# Altium project only pins.PrjPcb
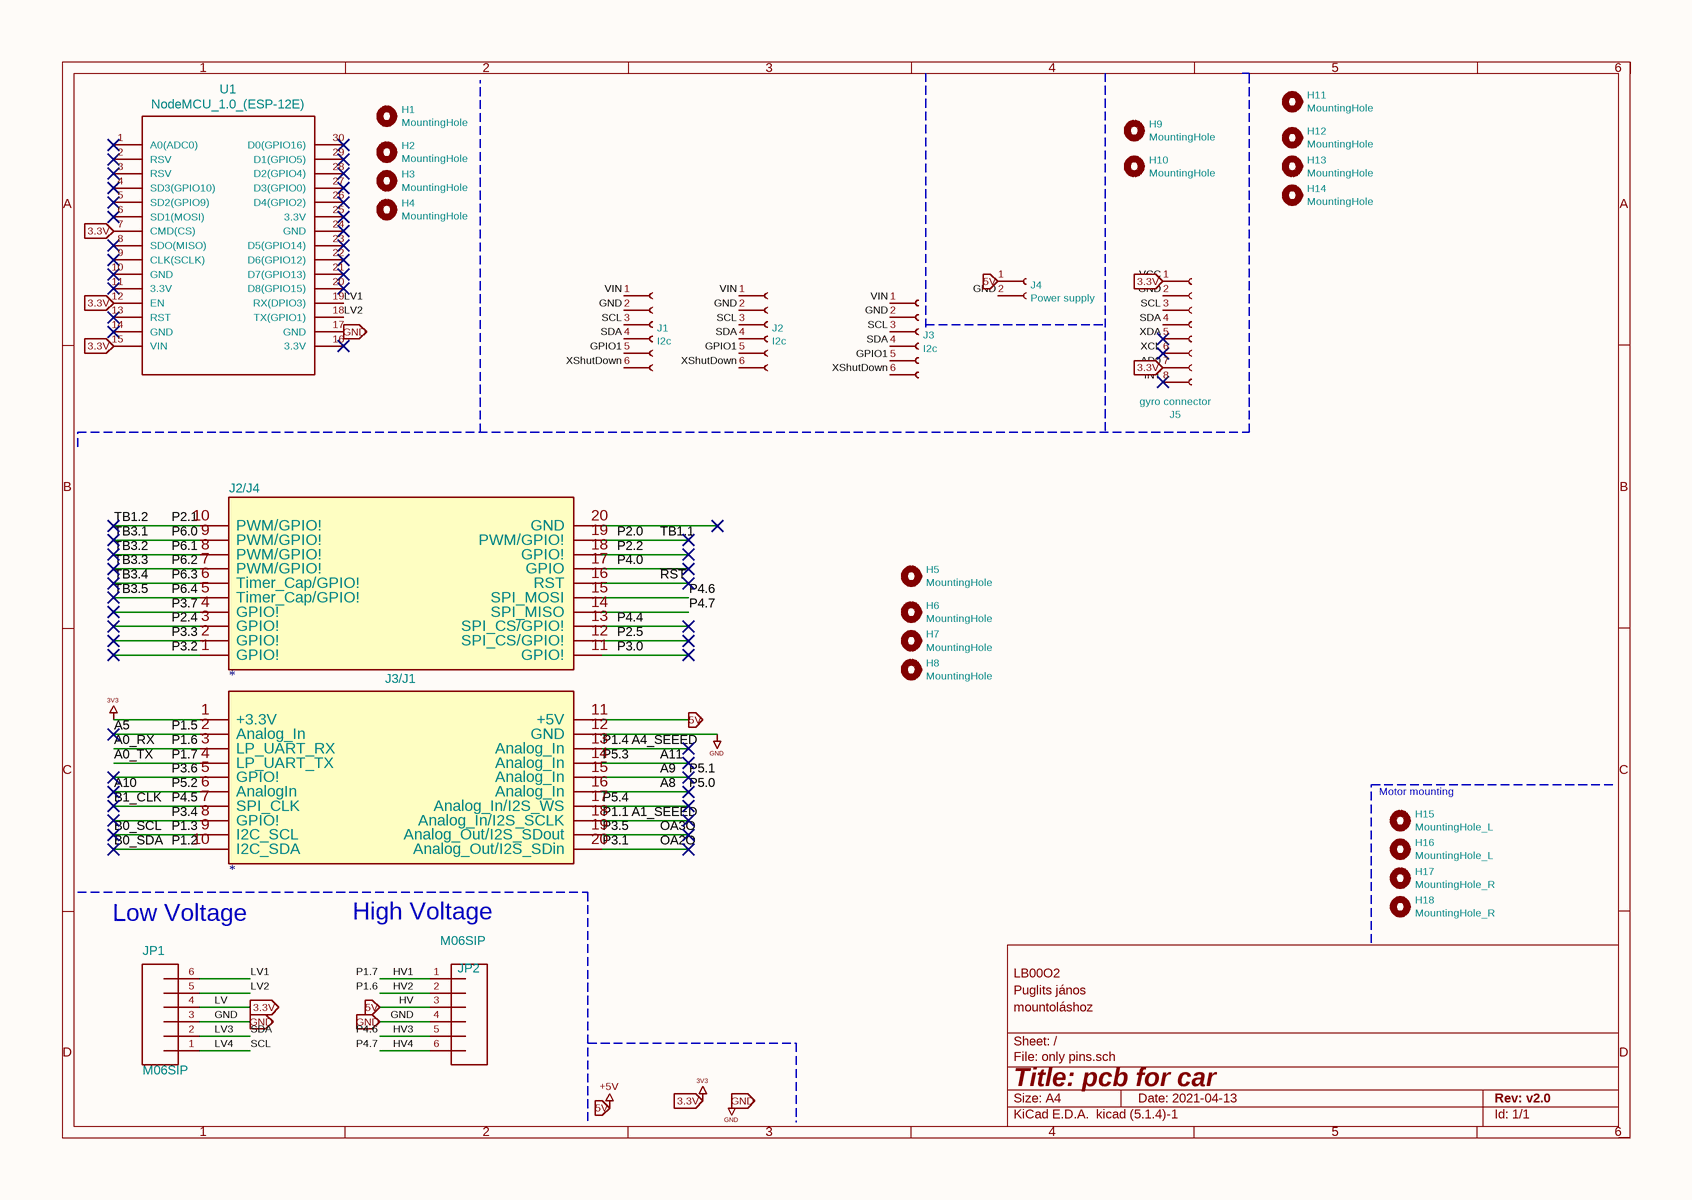
[diagram p0: only pins.SchDoc]
1 sheet, 28 parts. Net scope: flat (ports and power ports of the same name join across sheets).
Board files: only pins.PcbDoc, only pins(1).PcbDoc

## Sheet only pins.SchDoc
size 297 x 210 mm

### Parts
H1  MountingHole  [MountingHole_2.7mm]
H2  MountingHole  [MountingHole_2.7mm]
H3  MountingHole  [MountingHole_2.7mm]
H4  MountingHole  [MountingHole_2.7mm]
H5  MountingHole  [MountingHole_2.7mm]
H6  MountingHole  [MountingHole_2.7mm]
H7  MountingHole  [MountingHole_2.7mm]
H8  MountingHole  [MountingHole_2.7mm]
H9  MountingHole  [MountingHole_2.7mm]
H10  MountingHole  [MountingHole_2.7mm]
H11  MountingHole  [MountingHole_2.7mm]
H12  MountingHole  [MountingHole_2.7mm]
H13  MountingHole  [MountingHole_2.7mm]
H14  MountingHole  [MountingHole_2.7mm]
H15  MountingHole_L  [MountingHole_2.7mm]
H16  MountingHole_L  [MountingHole_2.7mm]
H17  MountingHole_R  [MountingHole_2.7mm]
H18  MountingHole_R  [MountingHole_2.7mm]
J1  I2c  [PinSocket_1x06_P2.54mm_Vertical]
J2  I2c  [PinSocket_1x06_P2.54mm_Vertical]
J2/J4  *  [PinSocket_2x10_P2.54mm_Vertical]
J3  I2c  [PinSocket_1x06_P2.54mm_Vertical]
J3/J1  *  [PinSocket_2x10_P2.54mm_Vertical]
J4  Power supply  [SolderWire-0.1sqmm_1x02_P3.6mm_D0.4mm_OD1mm]
J5  gyro connector  [PinSocket_1x08_P2.54mm_Vertical]
JP1  M06SIP  [PinSocket_1x06_P2.54mm_Vertical]
JP2  M06SIP  [PinSocket_1x06_P2.54mm_Vertical]
U1  NodeMCU_1.0_(ESP-12E)  [NodeMCU1.0(12-E)]

### Ports
3.3V, 5V, GND

### Nets
AD0: J3/J1.1(+3.3V) J5.1(Pin_1) J5.7(Pin_7) JP1.4 U1.7(CMD(CS)) U1.12(EN) U1.15(VIN) ; port 3.3V  [also labelled 3V3, LV, VCC]
GND: J1.2(Pin_2) J2.2(Pin_2) J3.2(Pin_2) J3/J1.12(GND) J4.2(Pin_2) J5.2(Pin_2) JP1.3 JP2.4 U1.17(GND) ; port GND
HV: J3/J1.11(+5V) J4.1(Pin_1) JP2.3 ; port 5V  [also labelled +5V]
A0_RX: J3/J1.3(LP_UART_RX) JP2.2  [also labelled HV2, P1.6]
A0_TX: J3/J1.4(LP_UART_TX) JP2.1  [also labelled HV1, P1.7]
A1_SEEED: J3/J1.18(Analog_In/I2S_SCLK)  [also labelled P1.1]
A4_SEEED: J3/J1.13(Analog_In)  [also labelled P1.4]
A5: J3/J1.2(Analog_In)  [also labelled P1.5]
A8: J3/J1.16(Analog_In)  [also labelled P5.0]
A9: J3/J1.15(Analog_In)  [also labelled P5.1]
A10: J3/J1.6(AnalogIn)  [also labelled P5.2]
A11: J3/J1.14(Analog_In)  [also labelled P5.3]
B0_SCL: J3/J1.9(I2C_SCL)  [also labelled P1.3]
B0_SDA: J3/J1.10(I2C_SDA)  [also labelled P1.2]
B1_CLK: J3/J1.7(SPI_CLK)  [also labelled P4.5]
GPIO1: J1.5(Pin_5) J2.5(Pin_5) J3.5(Pin_5)
HV3: J2/J4.15(SPI_MOSI) JP2.5  [also labelled P4.6]
HV4: J2/J4.14(SPI_MISO) JP2.6  [also labelled P4.7]
INT: J5.8(Pin_8)
LV1: JP1.6 U1.19(RX(DPIO3))
LV2: JP1.5 U1.18(TX(GPIO1))
LV3: J1.4(Pin_4) J2.4(Pin_4) J3.4(Pin_4) J5.4(Pin_4) JP1.2  [also labelled SDA]
LV4: J1.3(Pin_3) J2.3(Pin_3) J3.3(Pin_3) J5.3(Pin_3) JP1.1  [also labelled SCL]
OA2O: J3/J1.20(Analog_Out/I2S_SDin)  [also labelled P3.1]
OA3O: J3/J1.19(Analog_Out/I2S_SDout)  [also labelled P3.5]
P2.0: J2/J4.19(PWM/GPIO!)  [also labelled TB1.1]
P2.1: J2/J4.10(PWM/GPIO!)  [also labelled TB1.2]
P2.2: J2/J4.18(GPIO!)
P2.4: J2/J4.3(GPIO!)
P2.5: J2/J4.12(SPI_CS/GPIO!)
P3.0: J2/J4.11(GPIO!)
P3.2: J2/J4.1(GPIO!)
P3.3: J2/J4.2(GPIO!)
P3.4: J3/J1.8(GPIO!)
P3.6: J3/J1.5(GPIO!)
P3.7: J2/J4.4(GPIO!)
P4.0: J2/J4.17(GPIO)
P4.4: J2/J4.13(SPI_CS/GPIO!)
P5.4: J3/J1.17(Analog_In/I2S_WS)
P6.0: J2/J4.9(PWM/GPIO!)  [also labelled TB3.1]
P6.1: J2/J4.8(PWM/GPIO!)  [also labelled TB3.2]
P6.2: J2/J4.7(PWM/GPIO!)  [also labelled TB3.3]
P6.3: J2/J4.6(Timer_Cap/GPIO!)  [also labelled TB3.4]
P6.4: J2/J4.5(Timer_Cap/GPIO!)  [also labelled TB3.5]
~{RST}: J2/J4.16(RST)
VIN: J1.1(Pin_1) J2.1(Pin_1) J3.1(Pin_1)
XCL: J5.6(Pin_6)
XDA: J5.5(Pin_5)
XShutDown: J1.6(Pin_6) J2.6(Pin_6) J3.6(Pin_6)

Not connected (* = marked no-connect by the designer): J2/J4 20(GND)*; U1 1(A0(ADC0))* 2(RSV)* 3(RSV)* 4(SD3(GPIO10))* 5(SD2(GPIO9))* 6(SD1(MOSI))* 8(SDO(MISO))* 9(CLK(SCLK))* 10(GND)* 11(3.3V)* 13(RST)* 14(GND)* 16(3.3V)* 20(D8(GPIO15))* 21(D7(GPIO13))* 22(D6(GPIO12))* 23(D5(GPIO14))* 24(GND)* 25(3.3V)* 26(D4(GPIO2))* 27(D3(GPIO0))* 28(D2(GPIO4))* 29(D1(GPIO5))* 30(D0(GPIO16))*

### Notes on the sheet
- (near H15) Motor mounting
- Low Voltage
- High Voltage
- 1
- 2
- 3
- 4
- 5
- 6
- A
- B
- C
- mountoláshoz
- Puglits jános
- LB00O2
- D
- Title: pcb for car
- File: only pins.sch
- Sheet: /
- KiCad E.D.A.  kicad (5.1.4)-1
- Size: A4
- Date: 2021-04-13
- Rev: v2.0
- Id: 1/1

### Library data of the parts
H15-H18 = MountingHole: Footprint: MountingHole:MountingHole_2.7mm
  H15 H16: Value: MountingHole_L
  H17 H18: Value: MountingHole_R
J1-J3 = Conn_01x06_Female: Value: I2c; Footprint: Connector_PinSocket_2.54mm:PinSocket_1x06_P2.54mm_Vertical
J2/J4 = BoosterPack_40pin_J2J4-edited: Footprint: Connector_PinSocket_2.54mm:PinSocket_2x10_P2.54mm_Vertical
J3/J1 = BoosterPack_40pin_J1J3-edited: Footprint: Connector_PinSocket_2.54mm:PinSocket_2x10_P2.54mm_Vertical
J4 = Conn_01x02_Female: Value: Power supply; Footprint: Connector_Wire:SolderWire-0.1sqmm_1x02_P3.6mm_D0.4mm_OD1mm
J5 = Conn_01x08_Female: Value: gyro connector; Footprint: Connector_PinSocket_2.54mm:PinSocket_1x08_P2.54mm_Vertical
H1-H14 = MountingHole: Value: MountingHole; Footprint: MountingHole:MountingHole_2.7mm
JP1 JP2 = M06SIP: Value: M06SIP; Footprint: Connector_PinSocket_2.54mm:PinSocket_1x06_P2.54mm_Vertical
U1 = NodeMCU_1.0_(ESP-12E): Value: NodeMCU_1.0_(ESP-12E); Footprint: ESP8266_2:NodeMCU1.0(12-E)